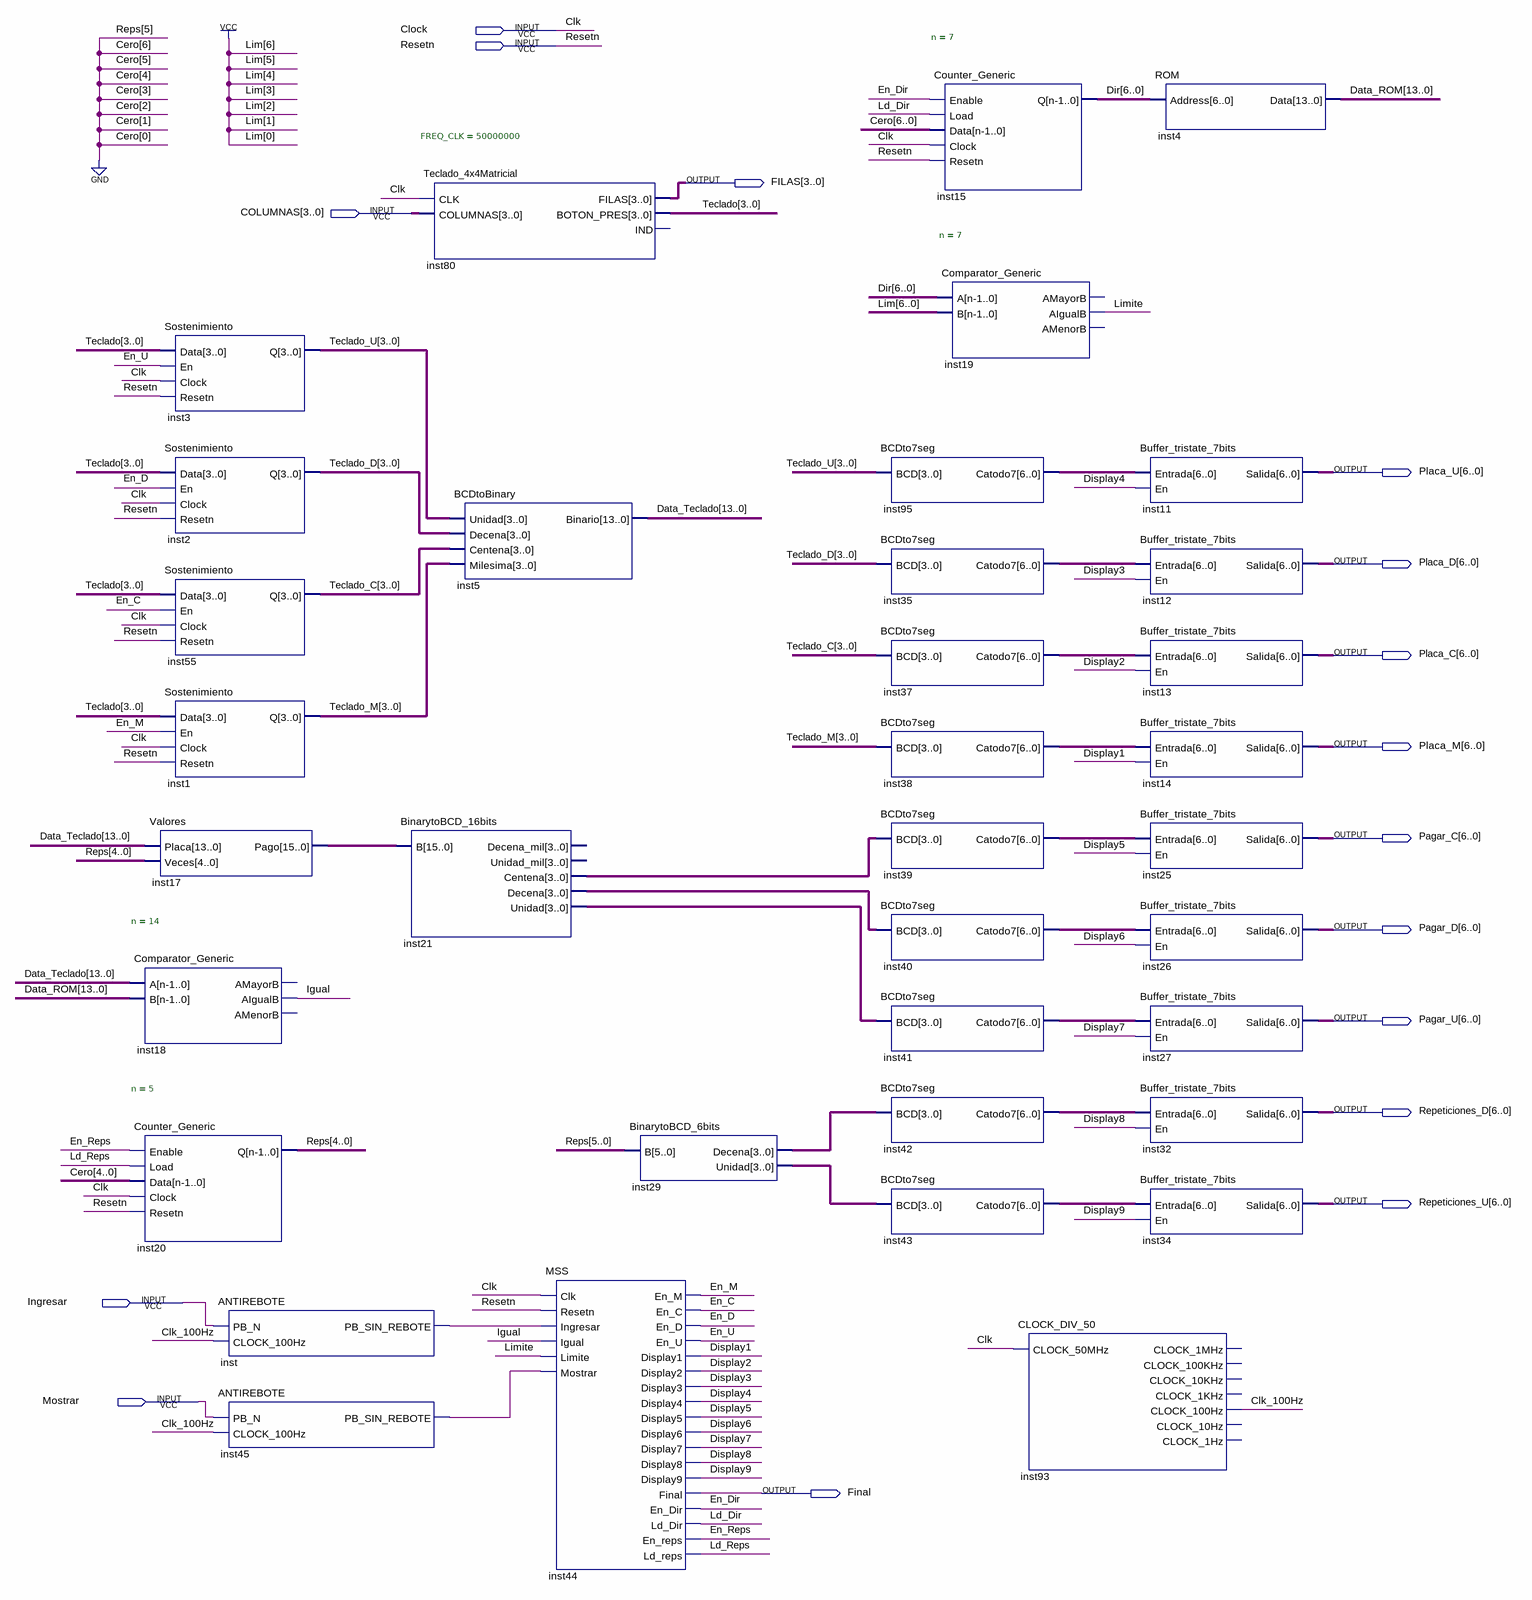
[diagram p0: schematic sheet]
// Quartus schematic Esquematico.bdf as structural Verilog: 36 symbols, 16 pins
module Esquematico (
  input  Clock,
  input  Resetn,
  input  [3:0] COLUMNAS,
  input  Ingresar,
  input  Mostrar,
  output [3:0] FILAS,
  output [6:0] Placa_U,
  output [6:0] Placa_D,
  output [6:0] Placa_C,
  output [6:0] Placa_M,
  output [6:0] Pagar_C,
  output [6:0] Pagar_D,
  output [6:0] Pagar_U,
  output [6:0] Repeticiones_D,
  output [6:0] Repeticiones_U,
  output Final
);

  wire Clk_100Hz, Display1, Display2, Display3, Display4, Display5, Display6, Display7, Display8, Display9,
       En_C, En_D, En_Dir, En_M, En_Reps, En_U, Igual, inst45_pb_sin_rebote, inst_pb_sin_rebote, Ld_Dir,
       Ld_Reps, Limite;
  wire [3:0] inst21_centena, inst21_decena, inst21_unidad, inst29_decena, inst29_unidad, Teclado, Teclado_C,
       Teclado_D, Teclado_M, Teclado_U;
  wire [4:0] Reps;
  wire [6:0] Dir, inst35_catodo7, inst37_catodo7, inst38_catodo7, inst39_catodo7, inst40_catodo7,
       inst41_catodo7, inst42_catodo7, inst43_catodo7, inst95_catodo7;
  wire [13:0] Data_ROM, Data_Teclado;
  wire [15:0] inst17_pago;

  Sostenimiento inst3 (.Data(Teclado), .En(En_U), .Clock(Clock), .Resetn(Resetn), .Q(Teclado_U));
  Sostenimiento inst2 (.Data(Teclado), .En(En_D), .Clock(Clock), .Resetn(Resetn), .Q(Teclado_D));
  Sostenimiento inst55 (.Data(Teclado), .En(En_C), .Clock(Clock), .Resetn(Resetn), .Q(Teclado_C));
  Sostenimiento inst1 (.Data(Teclado), .En(En_M), .Clock(Clock), .Resetn(Resetn), .Q(Teclado_M));
  Valores inst17 (.Placa(Data_Teclado), .Veces(Reps), .Pago(inst17_pago));
  Comparator_Generic #(.n(14)) inst18 (.A(Data_Teclado), .B(Data_ROM), .AIgualB(Igual));  // open: AMayorB, AMenorB
  Counter_Generic #(.n(5)) inst20 (
    .Enable(En_Reps), .Load(Ld_Reps), .Data({5{1'b0}}), .Clock(Clock), .Resetn(Resetn), .Q(Reps));
  ANTIREBOTE inst (.PB_N(Ingresar), .CLOCK_100Hz(Clk_100Hz), .PB_SIN_REBOTE(inst_pb_sin_rebote));
  ANTIREBOTE inst45 (.PB_N(Mostrar), .CLOCK_100Hz(Clk_100Hz), .PB_SIN_REBOTE(inst45_pb_sin_rebote));
  BinarytoBCD_16bits inst21 (
    .B(inst17_pago), .Centena(inst21_centena), .Decena(inst21_decena), .Unidad(inst21_unidad));  // open: Decena_mil, Unidad_mil
  Teclado_4x4Matricial #(.FREQ_CLK(50000000)) inst80 (
    .CLK(Clock), .COLUMNAS(COLUMNAS), .FILAS(FILAS), .BOTON_PRES(Teclado));  // open: IND
  BCDtoBinary inst5 (
    .Unidad(Teclado_U), .Decena(Teclado_D), .Centena(Teclado_C), .Milesima(Teclado_M), .Binario(Data_Teclado));
  MSS inst44 (
    .Clk(Clock), .Resetn(Resetn), .Ingresar(inst_pb_sin_rebote), .Igual(Igual), .Limite(Limite),
    .Mostrar(inst45_pb_sin_rebote), .En_M(En_M), .En_C(En_C), .En_D(En_D), .En_U(En_U), .Display1(Display1),
    .Display2(Display2), .Display3(Display3), .Display4(Display4), .Display5(Display5), .Display6(Display6),
    .Display7(Display7), .Display8(Display8), .Display9(Display9), .Final(Final), .En_Dir(En_Dir),
    .Ld_Dir(Ld_Dir), .En_reps(En_Reps), .Ld_reps(Ld_Reps));
  BinarytoBCD_6bits inst29 (.B({1'b0, Reps}), .Decena(inst29_decena), .Unidad(inst29_unidad));
  BCDto7seg inst95 (.BCD(Teclado_U), .Catodo7(inst95_catodo7));
  BCDto7seg inst35 (.BCD(Teclado_D), .Catodo7(inst35_catodo7));
  BCDto7seg inst37 (.BCD(Teclado_C), .Catodo7(inst37_catodo7));
  BCDto7seg inst38 (.BCD(Teclado_M), .Catodo7(inst38_catodo7));
  BCDto7seg inst39 (.BCD(inst21_centena), .Catodo7(inst39_catodo7));
  BCDto7seg inst40 (.BCD(inst21_decena), .Catodo7(inst40_catodo7));
  BCDto7seg inst41 (.BCD(inst21_unidad), .Catodo7(inst41_catodo7));
  BCDto7seg inst42 (.BCD(inst29_decena), .Catodo7(inst42_catodo7));
  BCDto7seg inst43 (.BCD(inst29_unidad), .Catodo7(inst43_catodo7));
  Counter_Generic #(.n(7)) inst15 (
    .Enable(En_Dir), .Load(Ld_Dir), .Data({7{1'b0}}), .Clock(Clock), .Resetn(Resetn), .Q(Dir));
  Comparator_Generic #(.n(7)) inst19 (.A(Dir), .B({7{1'b1}}), .AIgualB(Limite));  // open: AMayorB, AMenorB
  CLOCK_DIV_50 inst93 (
    .CLOCK_50MHz(Clock), .CLOCK_100Hz(Clk_100Hz));  // open: CLOCK_1MHz, CLOCK_100KHz, CLOCK_10KHz, CLOCK_1KHz, CLOCK_10Hz, CLOCK_1Hz
  Buffer_tristate_7bits inst11 (.Entrada(inst95_catodo7), .En(Display4), .Salida(Placa_U));
  Buffer_tristate_7bits inst12 (.Entrada(inst35_catodo7), .En(Display3), .Salida(Placa_D));
  Buffer_tristate_7bits inst13 (.Entrada(inst37_catodo7), .En(Display2), .Salida(Placa_C));
  Buffer_tristate_7bits inst14 (.Entrada(inst38_catodo7), .En(Display1), .Salida(Placa_M));
  Buffer_tristate_7bits inst25 (.Entrada(inst39_catodo7), .En(Display5), .Salida(Pagar_C));
  Buffer_tristate_7bits inst26 (.Entrada(inst40_catodo7), .En(Display6), .Salida(Pagar_D));
  Buffer_tristate_7bits inst27 (.Entrada(inst41_catodo7), .En(Display7), .Salida(Pagar_U));
  Buffer_tristate_7bits inst32 (.Entrada(inst42_catodo7), .En(Display8), .Salida(Repeticiones_D));
  Buffer_tristate_7bits inst34 (.Entrada(inst43_catodo7), .En(Display9), .Salida(Repeticiones_U));
  ROM inst4 (.Address(Dir), .Data(Data_ROM));

  // Other names for the same wires on the sheet: Clk = Clock
endmodule
